# EAGLE design expansion_module_hdmi_out (EAGLE 8.0.0)
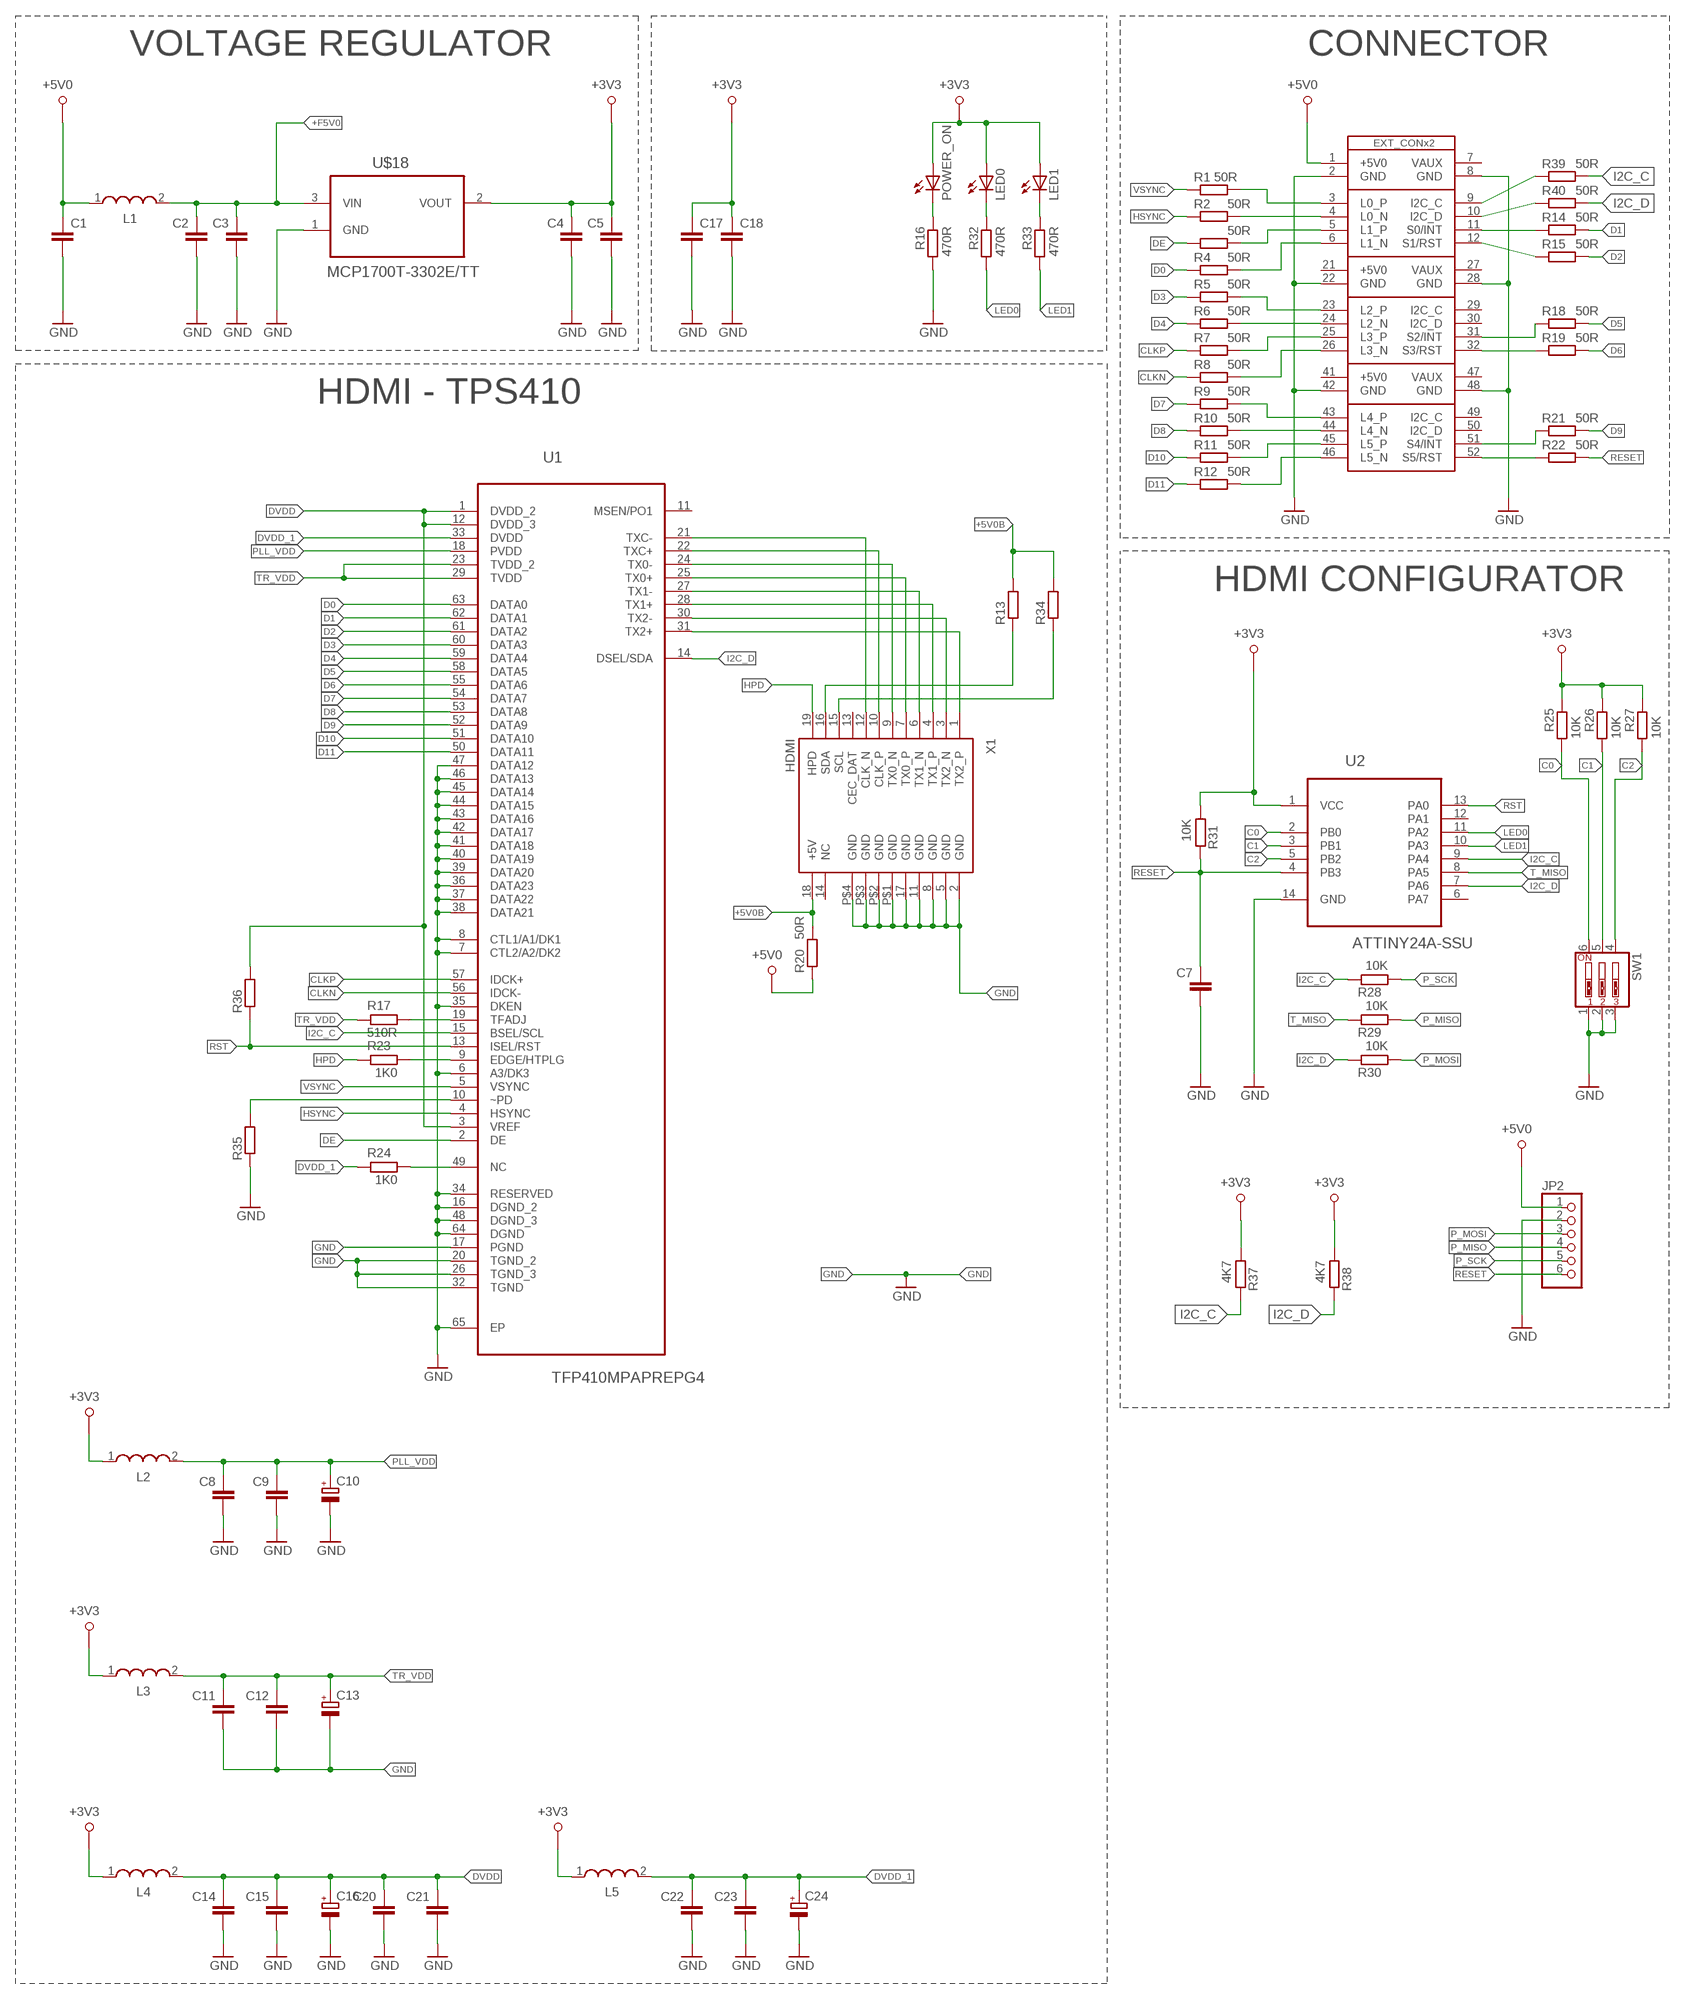
[diagram p0: schematic, sheet 1]

## Parts
C1  C-EUC1210K  [C1210K]
C2  C-EUC0805  [C0805]
C3  C-EUC0805  [C0805]
C4  C-EUC0805  [C0805]
C5  C-EUC0805  [C0805]
C7  C-EUC0805  [C0805]
C8  C-EUC0805  [C0805]
C9  C-EUC0805  [C0805]
C10  CPOL-EUSMCB  [SMC_B]
C11  C-EUC0805  [C0805]
C12  C-EUC0805  [C0805]
C13  CPOL-EUSMCB  [SMC_B]
C14  C-EUC0805  [C0805]
C15  C-EUC0805  [C0805]
C16  CPOL-EUSMCB  [SMC_B]
C17  C-EUC1210K  [C1210K]
C18  C-EUC1210K  [C1210K]
C20  C-EUC0805  [C0805]
C21  C-EUC0805  [C0805]
C22  C-EUC0805  [C0805]
C23  C-EUC0805  [C0805]
C24  CPOL-EUSMCB  [SMC_B]
JP2  PINHD-1X6  [1X06]
L1  WE-LQ_1210  [WE-LQ_M]
L2  WE-LQ_1210  [WE-LQ_M]
L3  WE-LQ_1210  [WE-LQ_M]
L4  WE-LQ_1210  [WE-LQ_M]
L5  WE-LQ_1210  [WE-LQ_M]
LED0  LEDCHIPLED_0805  [CHIPLED_0805]
LED1  LEDCHIPLED_0805  [CHIPLED_0805]
POWER_ON  LEDCHIPLED_0805  [CHIPLED_0805]
R1  50R  R-EU_R0805  [R0805]
R2  50R  R-EU_R0805  [R0805]
R3  50R  R-EU_R0805  [R0805]
R4  50R  R-EU_R0805  [R0805]
R5  50R  R-EU_R0805  [R0805]
R6  50R  R-EU_R0805  [R0805]
R7  50R  R-EU_R0805  [R0805]
R8  50R  R-EU_R0805  [R0805]
R9  50R  R-EU_R0805  [R0805]
R10  50R  R-EU_R0805  [R0805]
R11  50R  R-EU_R0805  [R0805]
R12  50R  R-EU_R0805  [R0805]
R13  R-EU_R0603  [R0603]
R14  50R  R-EU_R0805  [R0805]
R15  50R  R-EU_R0805  [R0805]
R16  470R  R-EU_R0805  [R0805]
R17  510R  R-EU_R0805  [R0805]
R18  50R  R-EU_R0805  [R0805]
R19  50R  R-EU_R0805  [R0805]
R20  50R  R-EU_R0805  [R0805]
R21  50R  R-EU_R0805  [R0805]
R22  50R  R-EU_R0805  [R0805]
R23  1K0  R-EU_R0805  [R0805]
R24  1K0  R-EU_R0805  [R0805]
R25  10K  R-EU_R0805  [R0805]
R26  10K  R-EU_R0805  [R0805]
R27  10K  R-EU_R0805  [R0805]
R28  10K  R-EU_R0805  [R0805]
R29  10K  R-EU_R0805  [R0805]
R30  10K  R-EU_R0805  [R0805]
R31  10K  R-EU_R0805  [R0805]
R32  470R  R-EU_R0805  [R0805]
R33  470R  R-EU_R0805  [R0805]
R34  R-EU_R0603  [R0603]
R35  R-EU_R0603  [R0603]
R36  R-EU_R0603  [R0603]
R37  4K7  R-EU_R0805  [R0805]
R38  4K7  R-EU_R0805  [R0805]
R39  50R  R-EU_R0805  [R0805]
R40  50R  R-EU_R0805  [R0805]
SW1  SW_DIP-3  [EDG-03]
U1  TFP410MPAPREPG4  [QFP50P1200X1200X120-65N]
U2  ATTINY24A-SSU  [SOIC127P600X175-14N]
U$1  SB_EXT_CON_X3  [SB_EXT_CON_X3_FULL]
U$18  MCP1700T-3302E/TT  [SOT95P237X112-3N]
X1  HDMI  [HDMI]

## Nets
+3V3: C4.2 C5.2 C17.1 C18.1 L2.1 L3.1 L4.1 L5.1 LED0.A LED1.A POWER_ON.A R25.2 R26.2 R27.2 R31.1 R37.1 R38.1 U2.1(VCC) U$18.2(VOUT)
+5V0: C1.1 JP2.1 L1.1 R20.1 U$1.1(+5V0)
+5V0B: R13.2 R20.2 R34.2 X1.18(+5V)
+F5V0: C2.2 C3.2 L1.2 U$18.3(VIN)
C0: R25.1 SW1.6 U2.2(PB0)
C1: R26.1 SW1.5 U2.3(PB1)
C2: R27.1 SW1.4 U2.5(PB2)
CLKN: R8.1 U1.56(IDCK-)
CLKP: R7.1 U1.57(IDCK+)
D0: R4.1 U1.63(DATA0)
D1: R14.2 U1.62(DATA1)
D2: R15.2 U1.61(DATA2)
D3: R5.1 U1.60(DATA3)
D4: R6.1 U1.59(DATA4)
D5: R18.2 U1.58(DATA5)
D6: R19.2 U1.55(DATA6)
D7: R9.1 U1.54(DATA7)
D8: R10.1 U1.53(DATA8)
D9: R21.2 U1.52(DATA9)
D10: R11.1 U1.51(DATA10)
D11: R12.1 U1.50(DATA11)
DE: R3.1 U1.2(DE)
DVDD: C14.2 C15.2 C16.+ C20.2 C21.2 L4.2 R36.2 U1.1(DVDD_2) U1.3(VREF) U1.12(DVDD_3)
DVDD_1: C22.2 C23.2 C24.+ L5.2 R24.2 U1.33(DVDD)
GND: C1.2 C2.1 C3.1 C4.1 C5.1 C7.1 C8.1 C9.1 C10.- C11.1 C12.1 C13.- C14.1 C15.1 C16.- C17.2 C18.2 C20.1 C21.1 C22.1 C23.1 C24.- JP2.2 R16.1 R35.1 SW1.1 SW1.2 SW1.3 U1.6(A3/DK3) U1.7(CTL2/A2/DK2) U1.8(CTL1/A1/DK1) U1.16(DGND_2) U1.17(PGND) U1.20(TGND_2) U1.26(TGND_3) U1.32(TGND) U1.34(RESERVED) U1.35(DKEN) U1.36(DATA23) U1.37(DATA22) U1.38(DATA21) U1.39(DATA20) U1.40(DATA19) U1.41(DATA18) U1.42(DATA17) U1.43(DATA16) U1.44(DATA15) U1.45(DATA14) U1.46(DATA13) U1.47(DATA12) U1.48(DGND_3) U1.64(DGND) U1.65(EP) U2.14(GND) U$1.2(GND) U$1.8(GND) U$1.22(GND) U$1.28(GND) U$1.42(GND) U$1.48(GND) U$18.1(GND) X1.2(GND) X1.5(GND) X1.8(GND) X1.11(GND) X1.17(GND) X1.P$1(GND) X1.P$2(GND) X1.P$3(GND) X1.P$4(GND)
HPD: R23.2 X1.19(HPD)
HSYNC: R2.1 U1.4(HSYNC)
I2C_C: R28.2 R37.2 R39.2 U1.15(BSEL/SCL) U2.9(PA4)
I2C_D: R30.2 R38.2 R40.2 U1.14(DSEL/SDA) U2.7(PA6)
LED0: R32.1 U2.11(PA2)
LED1: R33.1 U2.10(PA3)
N$1: R1.2 U$1.3(L0_P)
N$2: R2.2 U$1.4(L0_N)
N$3: R3.2 U$1.5(L1_P)
N$4: R4.2 U$1.6(L1_N)
N$5: R5.2 U$1.23(L2_P)
N$6: R15.1 U$1.12(S1/RST)
N$7: R14.1 U$1.11(S0/INT)
N$8: LED0.C R32.2
N$9: R18.1 U$1.31(S2/INT)
N$11: R6.2 U$1.24(L2_N)
N$12: R17.1 U1.19(TFADJ)
N$13: R7.2 U$1.25(L3_P)
N$14: R8.2 U$1.26(L3_N)
N$15: R9.2 U$1.43(L4_P)
N$16: R10.2 U$1.44(L4_N)
N$17: R11.2 U$1.45(L5_P)
N$19: R19.1 U$1.32(S3/RST)
N$20: R34.1 X1.15(SCL)
N$21: R21.1 U$1.51(S4/INT)
N$22: R22.1 U$1.52(S5/RST)
N$23: POWER_ON.C R16.2
N$24: U1.31(TX2+) X1.1(TX2_P)
N$25: U1.30(TX2-) X1.3(TX2_N)
N$30: U1.28(TX1+) X1.4(TX1_P)
N$31: U1.27(TX1-) X1.6(TX1_N)
N$32: U1.25(TX0+) X1.7(TX0_P)
N$33: U1.24(TX0-) X1.9(TX0_N)
N$34: U1.22(TXC+) X1.10(CLK_P)
N$35: R12.2 U$1.46(L5_N)
N$36: U1.21(TXC-) X1.12(CLK_N)
N$37: R35.2 U1.10(~PD)
N$39: R24.1 U1.49(NC)
N$42: R23.1 U1.9(EDGE/HTPLG)
N$43: LED1.C R33.2
N$44: R13.1 X1.16(SDA)
N$48: R40.1 U$1.10(I2C_D)
N$49: R39.1 U$1.9(I2C_C)
P_MISO: JP2.4 R29.1
P_MOSI: JP2.3 R30.1
P_SCK: JP2.5 R28.1
PLL_VDD: C8.2 C9.2 C10.+ L2.2 U1.18(PVDD)
RESET: C7.2 JP2.6 R22.2 R31.2 U2.4(PB3)
RST: R36.1 U1.13(ISEL/RST) U2.13(PA0)
T_MISO: R29.2 U2.8(PA5)
TR_VDD: C11.2 C12.2 C13.+ L3.2 R17.2 U1.23(TVDD_2) U1.29(TVDD)
VSYNC: R1.1 U1.5(VSYNC)
Unconnected: U1.11(MSEN/PO1) U2.6(PA7) U2.12(PA1) U$1.7(VAUX) U$1.21(+5V0) U$1.27(VAUX) U$1.29(I2C_C) U$1.30(I2C_D) U$1.41(+5V0) U$1.47(VAUX) U$1.49(I2C_C) U$1.50(I2C_D) X1.13(CEC_DAT) X1.14(NC)

## Notes on the sheet
- VOLTAGE REGULATOR | CONNECTOR
- HDMI - TPS410
- HDMI CONFIGURATOR

## Library data of the parts
C1-C5 C7-C9 C11 C12 C14 C15 C17 C18 C20-C23 = resistor:C-EU: CAPACITOR, European symbol
C10 C13 C16 C24 = resistor:CPOL-EU: POLARIZED CAPACITOR, European symbol
JP2 = pinhead:PINHD-1X6: PIN HEADER
L1-L5 = EagleLibrary_Wuerth_Elektronik_eiSos_rev16a:WE-LQ: SMD Inductor Characteristics Miniature chip inductor wound on a special ferrite core Small inductances for compact circuits High Q at high frequencies Low DC-resistance Operating temperature: –40 ºC to +125 ºC Applications Low power DC/DC-converters from Linear Technology, National Semiconductor, Texas Instruments, Fairchild Semiconductor, ON Semiconductor, STMicroelectronics, Maxim, MPS, Semtech, Exar, Analogic Tech, Diodes and Cologne Chip EMI-Filtering RF-circuits <http://katalog.we-online.de/media/images/eisos/IndLQ_pf2.jpg> Details see: http://katalog.we-online.de/en/pbs/WE-LQ? Updated by Dan Xu 2014-07-08 2014 (C) Wurth Elektronik
LED0 LED1 POWER_ON = led:LED: LED OSRAM: - CHIPLED LG R971, LG N971, LY N971, LG Q971, LY Q971, LO R971, LY R971 LH N974, LH R974 LS Q976, LO Q976, LY Q976 LO Q996 - Hyper CHIPLED LW Q18S LB Q993, LB Q99A, LB R99A - SideLED LS A670, LO A670, LY A670, LG A670, LP A670 LB A673, LV A673, LT A673, LW A673 LH A674 LY A675 LS A676, LA A676, LO A676, LY A676, LW A676 LS A679, LY A679, LG A679 - Hyper Micro SIDELED® LS Y876, LA Y876, LO Y876, LY Y876 LT Y87S - SmartLED LW L88C, LW L88S LB L89C, LB L89S, LG L890 LS L89K, LO L89K, LY L89K LS L896, LA L896, LO L896, LY L896 - TOPLED LS T670, LO T670, LY T670, LG T670, LP T670 LSG T670, LSP T670, LSY T670, LOP T670, LYG T670 LG T671, LOG T671, LSG T671 LB T673, LV T673, LT T673, LW T673 LH T674 LS T676, LA T676, LO T676, LY T676, LB T676, LH T676, LSB T676, LW T676 LB T67C, LV T67C, LT T67C, LS T67K, LO T67K, LY T67K, LW E67C LS E67B, LA E67B, LO E67B, LY E67B, LB E67C, LV E67C, LT E67C LW T67C LS T679, LY T679, LG T679 LS T770, LO T770, LY T770, LG T770, LP T770 LB T773, LV T773, LT T773, LW T773 LH T774 LS E675, LA E675, LY E675, LS T675 LS T776, LA T776, LO T776, LY T776, LB T776 LHGB T686 LT T68C, LB T68C - Hyper Mini TOPLED® LB M676 - Mini TOPLED Santana® LG M470 LS M47K, LO M47K, LY M47K Source: http://www.osram.convergy.de LUXEON: - LUMILED® LXK2-PW12-R00, LXK2-PW12-S00, LXK2-PW14-U00, LXK2-PW14-V00 LXK2-PM12-R00, LXK2-PM12-S00, LXK2-PM14-U00 LXK2-PE12-Q00, LXK2-PE12-R00, LXK2-PE12-S00, LXK2-PE14-T00, LXK2-PE14-U00 LXK2-PB12-K00, LXK2-PB12-L00, LXK2-PB12-M00, LXK2-PB14-N00, LXK2-PB14-P00, LXK2-PB14-Q00 LXK2-PR12-L00, LXK2-PR12-M00, LXK2-PR14-Q00, LXK2-PR14-R00 LXK2-PD12-Q00, LXK2-PD12-R00, LXK2-PD12-S00 LXK2-PH12-R00, LXK2-PH12-S00 LXK2-PL12-P00, LXK2-PL12-Q00, LXK2-PL12-R00 Source: www.luxeon.com KINGBRIGHT: KA-3528ASYC Source: www.kingbright.com
R1-R40 = resistor:R-EU_: RESISTOR, European symbol
SW1 = special:SW_DIP-3: DIP SWITCH
U1 = TFP410MPAPREPG4:TFP410MPAPREPG4: Digital Transmitter; AVAILABILITY: Good; DESCRIPTION: Enhanced Product Panelbus(Tm) Digital Transmitter 64-HTQFP -55 to 125; MF: Texas Instruments; MP: TFP410MPAPREPG4; PACKAGE: HTQFP-64 Texas Instruments; PRICE: 8.01 USD
U2 = Atmel_By_element14_Batch_1-00:ATTINY24A-SSU: 8-bit Microcontroller with In-System Programmable Flash; MPN: ATTINY24A-SSU; OC_FARNELL: 1699395; OC_NEWARK: 80P3681; PACKAGE: SOIC-14; SUPPLIER: Atmel
U$1 = al_smartboard:SB_EXT_CON_X3
U$18 = Microchip_By_element14_Batch_1:MCP1700T-3302E/TT: Low Quiescent Current LDO; MPN: MCP1700T-3302E/TT; OC_FARNELL: 1296592; OC_NEWARK: 88H9817; PACKAGE: SOT23-3; SUPPLIER: Microchip
X1 = raspberrypi_cm_al:HDMI

## Net classes
0 default: clearance 0.205 mm

## Board
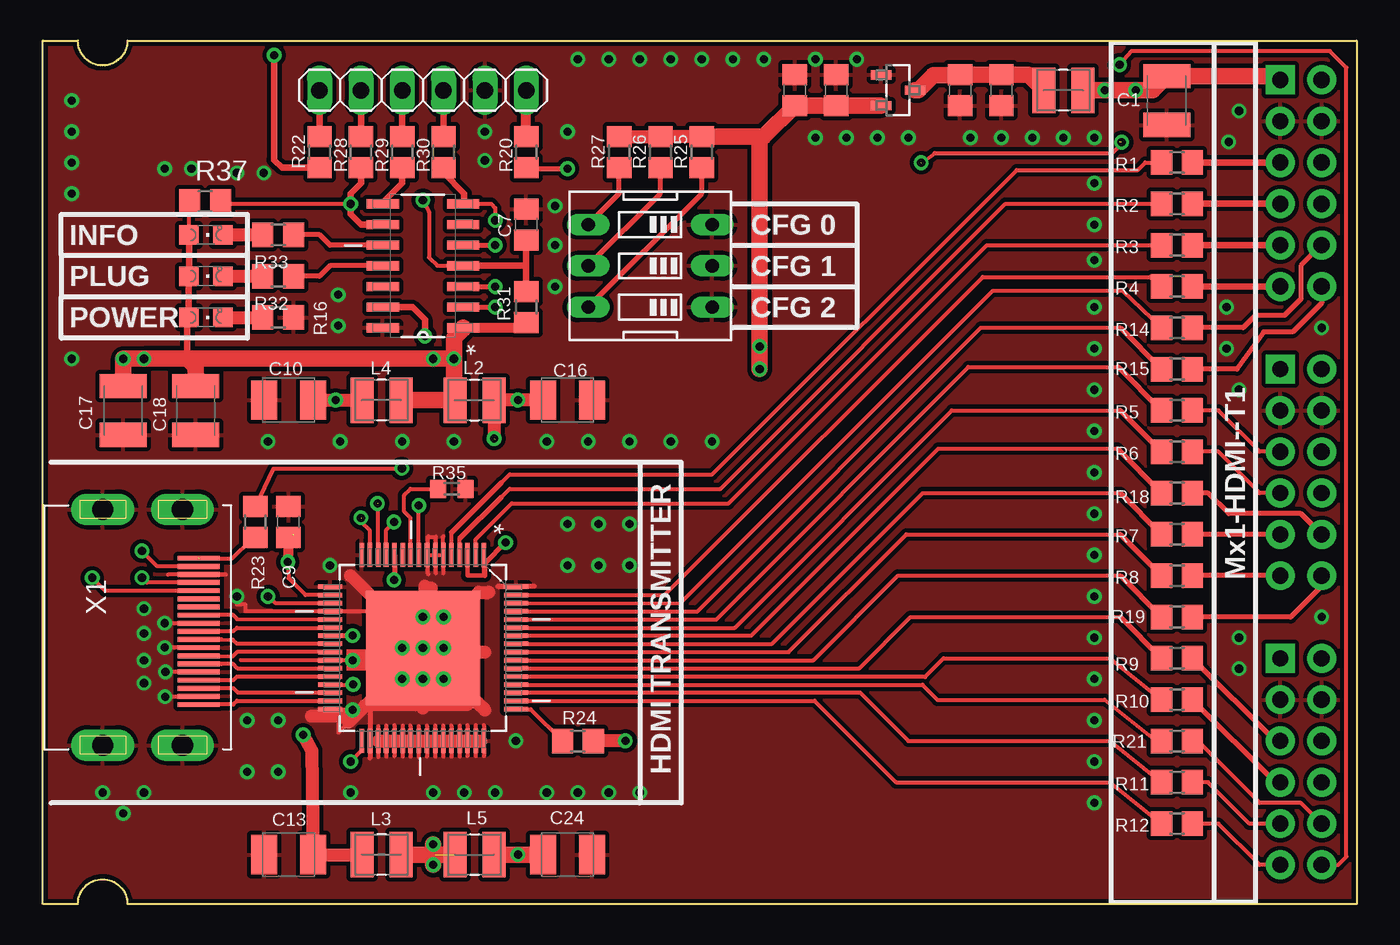
[diagram p1: board, top side]
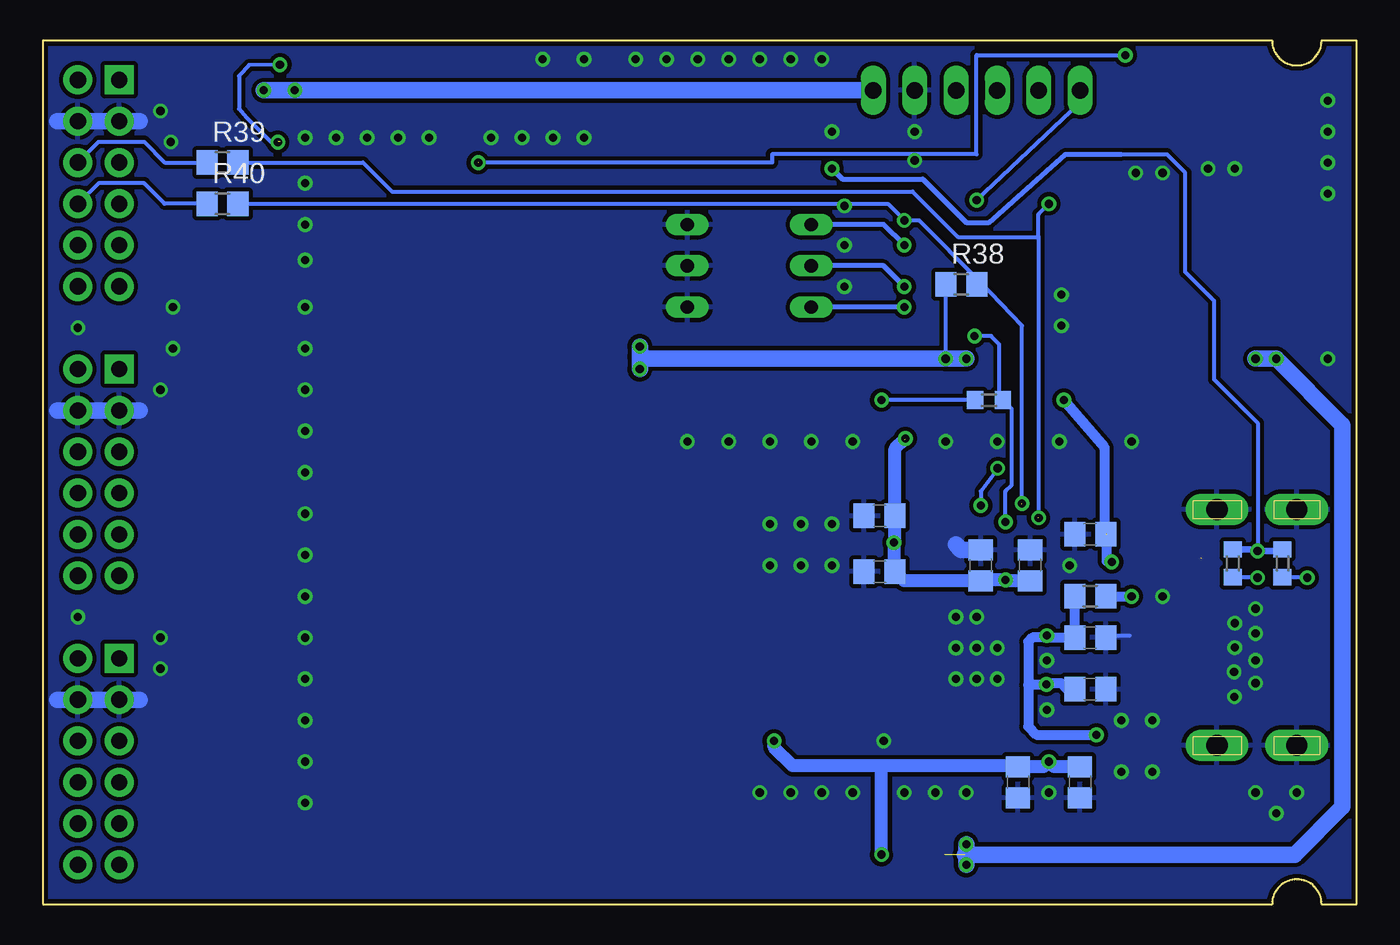
[diagram p2: board, bottom side, seen from below]

Size 80.77 x 53.09 mm. Coordinates in mm from the lower left corner, seen from the top.
Copper layers (1*16): Top 0.035mm / dielectric 1.5mm / Bottom 0.035mm
Design rules "default *": minimum track width 10mil, minimum drill 24mil, track to track 10mil, track to pad 8mil, pad to pad 8mil, via to via 8mil, smd to smd 8mil, copper to edge 10mil, drill to drill 10mil, minimum pad ring 10mil, minimum via ring 8mil, stop-mask expansion 4mil, vias tented up to drill 20mil, thermal gap 10mil

### Footprints (pad centres in the part's own frame; a part is rotated, then mirrored left to right if it is on the bottom)
C1210K = smd 1.5 x 2.9: 1 -1.5,0; 2 1.5,0
C0805 = smd 1.3 x 1.5: 1 -0.95,0; 2 0.95,0
SMC_B = smd 1.6 x 2.4: + -1.5,0; - 1.5,0
1X06 = drill 1.016 long: 1 -6.35,0; 2 -3.81,0; 3 -1.27,0; 4 1.27,0; 5 3.81,0; 6 6.35,0
WE-LQ_M = smd 1.4 x 2.8: 1 -1.2,0; 2 1.2,0
CHIPLED_0805 = smd 1.2 x 1.2: A 0,-1.05; C 0,1.05
R0805 = smd 1.3 x 1.5: 1 -0.95,0; 2 0.95,0
R0603 = smd 1 x 1.1: 1 -0.85,0; 2 0.85,0
EDG-03 = drill 0.813 long: 1 -2.54,-3.81; 2 0,-3.81; 3 2.54,-3.81; 4 2.54,3.81; 5 0,3.81; 6 -2.54,3.81
QFP50P1200X1200X120-65N = smd 1.473 x 0.279: 1 -5.715,3.759; 2 -5.715,3.251; 3 -5.715,2.743; 4 -5.715,2.261; 5 -5.715,1.753; 6 -5.715,1.245; 7 -5.715,0.762; 8 -5.715,0.254; 9 -5.715,-0.254; 10 -5.715,-0.762; 11 -5.715,-1.245; 12 -5.715,-1.753; 13 -5.715,-2.261; 14 -5.715,-2.743; 15 -5.715,-3.251; 16 -5.715,-3.759; 33 5.715,-3.759; 34 5.715,-3.251; 35 5.715,-2.743; 36 5.715,-2.261; 37 5.715,-1.753; 38 5.715,-1.245; 39 5.715,-0.762; 40 5.715,-0.254; 41 5.715,0.254; 42 5.715,0.762; 43 5.715,1.245; 44 5.715,1.753; 45 5.715,2.261; 46 5.715,2.743; 47 5.715,3.251; 48 5.715,3.759 | smd 0.279 x 1.473: 17 -3.759,-5.715; 18 -3.251,-5.715; 19 -2.743,-5.715; 20 -2.261,-5.715; 21 -1.753,-5.715; 22 -1.245,-5.715; 23 -0.762,-5.715; 24 -0.254,-5.715; 25 0.254,-5.715; 26 0.762,-5.715; 27 1.245,-5.715; 28 1.753,-5.715; 29 2.261,-5.715; 30 2.743,-5.715; 31 3.251,-5.715; 32 3.759,-5.715; 49 3.759,5.715; 50 3.251,5.715; 51 2.743,5.715; 52 2.261,5.715; 53 1.753,5.715; 54 1.245,5.715; 55 0.762,5.715; 56 0.254,5.715; 57 -0.254,5.715; 58 -0.762,5.715; 59 -1.245,5.715; 60 -1.753,5.715; 61 -2.261,5.715; 62 -2.743,5.715; 63 -3.251,5.715; 64 -3.759,5.715 | smd 7.01 x 7.01: 65 0,0
SOIC127P600X175-14N = smd 1.981 x 0.559: 1 -2.464,3.81; 2 -2.464,2.54; 3 -2.464,1.27; 4 -2.464,0; 5 -2.464,-1.27; 6 -2.464,-2.54; 7 -2.464,-3.81; 8 2.464,-3.81; 9 2.464,-2.54; 10 2.464,-1.27; 11 2.464,0; 12 2.464,1.27; 13 2.464,2.54; 14 2.464,3.81
SB_EXT_CON_X3_FULL = drill 1 pad 1.778 square: 1 50.8,5.08; 21 33.02,5.08; 41 15.24,5.08 | drill 1 pad 1.778: 2 48.26,5.08; 3 45.72,5.08; 4 43.18,5.08; 5 40.64,5.08; 6 38.1,5.08; 7 50.8,2.54; 8 48.26,2.54; 9 45.72,2.54; 10 43.18,2.54; 11 40.64,2.54; 12 38.1,2.54; 22 30.48,5.08; 23 27.94,5.08; 24 25.4,5.08; 25 22.86,5.08; 26 20.32,5.08; 27 33.02,2.54; 28 30.48,2.54; 29 27.94,2.54; 30 25.4,2.54; 31 22.86,2.54; 32 20.32,2.54; 42 12.7,5.08; 43 10.16,5.08; 44 7.62,5.08; 45 5.08,5.08; 46 2.54,5.08; 47 15.24,2.54; 48 12.7,2.54; 49 10.16,2.54; 50 7.62,2.54; 51 5.08,2.54; 52 2.54,2.54
SOT95P237X112-3N = smd 0.559 x 1.27: 1 -0.94,-1.041; 2 0.94,-1.041; 3 0,1.041
HDMI = smd 0.3 x 2.6: 1 4.75,4; 2 4.25,4; 3 3.75,4; 4 3.25,4; 5 2.75,4; 6 2.25,4; 7 1.75,4; 8 1.25,4; 9 0.75,4; 10 0.25,4; 11 -0.25,4; 12 -0.75,4; 13 -1.25,4; 14 -1.75,4; 15 -2.25,4; 16 -2.75,4; 17 -3.25,4; 18 -3.75,4; 19 -4.25,4 | drill 1.3 long: P$1 7.25,3; P$2 -7.25,3; P$3 -7.25,-1.9; P$4 7.25,-1.9

### Placement (x,y rotation side)
C1  69.09,49.4 270 top
C2  56.39,50.04 90 top
C3  58.93,50.04 90 top
C4  48.77,50.04 270 top
C5  46.23,50.04 270 top
C7  29.72,41.78 270 top
C8  16.38,22.73 0 bottom
C9  15.11,23.5 270 top
C10  15.11,30.99 180 top
C11  16.38,16.38 180 bottom
C12  16.38,13.21 180 bottom
C13  15.11,3.05 180 top
C14  29.34,23.88 0 bottom
C15  20.07,20.83 270 bottom
C16  32.26,30.99 0 top
C17  4.95,30.35 270 top
C18  9.4,30.35 270 top
C20  23.11,20.83 270 bottom
C21  29.34,20.45 0 bottom
C22  20.83,7.49 90 bottom
C23  17.02,7.49 90 bottom
C24  32.26,3.05 0 top
JP2  23.37,50.04 180 top
L1  62.74,50.04 180 top
L2  20.83,30.99 180 top
L3  20.83,3.05 180 top
L4  26.54,30.99 0 top
L5  26.54,3.05 0 top
LED0  10.03,38.61 270 top
LED1  10.03,41.15 270 top
POWER_ON  10.03,36.07 270 top
R1  69.72,45.59 0 top
R2  69.72,43.05 0 top
R3  69.72,40.51 0 top
R4  69.72,37.97 0 top
R5  69.72,30.35 0 top
R6  69.72,27.81 0 top
R7  69.72,22.73 0 top
R8  69.72,20.19 0 top
R9  69.72,15.11 0 top
R10  69.72,12.57 0 top
R11  69.72,7.49 0 top
R12  69.72,4.95 0 top
R13  7.62,20.96 90 bottom
R14  69.72,35.43 180 top
R15  69.72,32.89 180 top
R16  14.48,36.07 180 top
R17  16.38,18.92 180 bottom
R18  69.72,25.27 180 top
R19  69.72,17.65 180 top
R20  29.72,46.23 270 top
R21  69.72,10.03 180 top
R22  17.02,46.23 90 top
R23  13.08,23.5 270 top
R24  32.89,10.03 0 top
R25  40.51,46.23 90 top
R26  37.97,46.23 90 top
R27  35.43,46.23 90 top
R28  19.56,46.23 270 top
R29  22.1,46.23 270 top
R30  24.64,46.23 270 top
R31  29.72,36.7 90 top
R32  14.48,38.61 180 top
R33  14.48,41.15 180 top
R34  4.57,20.96 90 bottom
R35  25.15,25.53 180 top
R36  22.61,30.99 180 bottom
R37  9.98,43.21 0 top
R38  24.31,38.1 0 bottom
R39  69.72,45.59 0 bottom
R40  69.72,43.05 0 bottom
SW1  37.34,39.24 90 top
U1  23.37,15.75 270 top
U2  23.37,39.24 180 top
U$1  81.15,-0.13 90 top
U$18  52.58,50.04 270 top
X1  5.59,17.02 270 top

### Tracks (layer width: path | path; a pad name or v marks a point on that pad's centre or on a via)
+3V3  (via drill 0.5)  (1 unrouted)
  Top 0.254: 9.02,38.48 9.02,38.57 LED0.A | R37.1 8.98,43.16 LED1.A
  Top 0.406: LED1.A 9.02,41.11 9.02,38.48 8.98,38.45 POWER_ON.A 8.89,35.98 8.89,33.53
  Top 0.61: U2.1 29.4,35.43 R31.1
  Top 0.813: R27.2 R26.2 R25.2
  Top 1.016: U$18.2 51.53,49.09 C4.2 C5.2 44.32,47.18 | 44.32,47.18 R25.2 | 44.32,47.18 44.07,46.93 v44.07,34.29 v44.07,32.89 | L2.1 L4.1 25.27,31.06 v25.27,33.53 | U2.1 25.83,35.36 25.27,34.8 v25.27,33.53 | 8.89,33.53 v24,33.53 v25.27,33.53 | 8.89,33.53 v6.22,33.53 v4.95,33.53 C17.1 | L5.1 L3.1 | C18.1 9.4,33.02 8.89,33.53
  Bottom 0.254: R38.1 25.27,37.66 v25.27,33.53
  Bottom 1.016: v44.07,34.29 44.07,33.66 | 44.07,33.66 v44.07,32.89 | 44.07,33.66 43.94,33.53 v25.27,33.53 v24,33.53 | v6.22,33.53 v4.95,33.53 0.89,29.46 0.89,5.97 3.81,3.05 24.07,3.05
+5V0  (via drill 0.5)
  Top 0.61: R20.1 JP2.1
  Top 1.016: U$1.1 75.84,50.9 C1.1 68.22,50.04 v67.18,50.04 v65.28,50.04 L1.1
  Bottom 1.016: v67.18,50.04 JP2.1
+5V0B  (via drill 0.5)
  Top 0.254: 9.58,20.78 X1.18 7.04,20.77 v6.1,21.72
  Top 0.305: R20.2 29.78,45.21 v32.26,45.21
  Bottom 0.254: 14.48,46.1 11.68,46.1 10.54,44.96 10.54,38.86 8.76,37.08 8.76,32.26 6.1,29.59 v6.1,21.72
  Bottom 0.305: v32.26,45.21 31.62,44.58 26.67,44.58 24,41.91 22.61,41.91 17.91,46.1 14.48,46.1
  Bottom 0.406: R13.2 6.18,21.81 v6.1,21.72 4.66,21.72 R34.2
+F5V0
  Top 1.016: L1.2 60.59,50.99 C3.2 C2.2 56.35,50.95 54.74,50.95 53.82,50.04 U$18.3
C0  (via drill 0.5)
  Top 0.305: SW1.6 40.51,43.69 R25.1 | U2.2 v27.81,36.7
  Bottom 0.305: v27.81,36.7 SW1.6
C1  (via drill 0.5)
  Top 0.305: SW1.5 37.97,43.69 R26.1 | U2.3 v27.81,37.97
  Bottom 0.305: v27.81,37.97 29.08,39.24 SW1.5
C2  (via drill 0.5)
  Top 0.305: SW1.4 35.43,43.69 R27.1 | U2.5 v27.81,40.51
  Bottom 0.305: v27.81,40.51 29.08,41.78 SW1.4
CLKN
  Top 0.254: 66.23,22.73 53.09,22.73 45.85,15.49 U1.56
  Top 0.305: 66.23,22.73 R8.1
CLKP
  Top 0.254: 66.23,25.27 54.1,25.27 44.83,16 U1.57
  Top 0.305: 66.23,25.27 R7.1
D0
  Top 0.254: R4.1 68.45,37.97 | R4.1 69.09,37.97 | R4.1 68.06,38.56 57.78,38.56 38.23,19 U1.63
  Top 0.305: 68.74,38 R4.1 68.57,38.18
D1
  Top 0.254: R14.2 66.36,37.72 58.42,37.72 39.22,18.52 29.16,18.49 U1.62
D2
  Top 0.254: U1.61 40.26,18.01 57.66,35.43 66.23,35.43
  Top 0.305: 66.23,35.43 R15.2
D3
  Top 0.254: U1.60 41.4,17.5 56.9,33.02 66.11,33.02
  Top 0.305: 66.11,33.02 R5.1
D4
  Top 0.254: U1.59 42.55,16.99 55.88,30.35 66.23,30.35
  Top 0.305: 66.23,30.35 R6.1
D5
  Top 0.254: 66.04,28 55.05,28 43.56,16.51 U1.58
  Top 0.305: 66.04,28 R18.2
D6
  Top 0.254: 66.23,20.19 52.58,20.19 47.37,14.99 U1.55
  Top 0.305: 66.23,20.19 R19.2
D7
  Top 0.254: 66.23,17.65 53.34,17.65 50.19,14.5 U1.54
  Top 0.305: 66.23,17.65 R9.1
D8
  Top 0.254: R10.1 65.6,15.11 55.37,15.11 54.23,13.97 54.2,13.99 U1.53
D9
  Top 0.254: R21.2 68.45,10.03 65.28,12.57 54.99,12.57 54.08,13.49 U1.52
D10
  Top 0.254: 65.6,10.03 R11.1 | 65.6,10.03 53.21,10.03 50.24,13 U1.51 | 65.6,10.03 65.59,10.04
D11
  Top 0.254: R12.1 65.6,7.49 52.45,7.49 47.45,12.5 U1.50
DE
  Top 0.254: U1.2 26.62,22.43 28.83,24.64 42.16,24.64 58.04,40.51 R3.1
  Top 0.305: R3.1
DVDD  (via drill 0.5)  (1 unrouted)
  Top 0.279: U1.3 26.11,20.19 27.18,20.19 27.13,20.24 U1.1
  Top 0.305: 27.18,20.19 27.18,20.96 v28.45,22.23 | U1.12 21.62,19.96 v21.59,19.94
  Top 0.813: C16.+ v29.21,30.99 L4.2 27.74,28.61 27.74,28.6
  Bottom 0.254: R36.2 v29.21,30.99
  Bottom 0.813: 27.81,28.58 28.39,28 C14.2 28.39,22.29 v28.45,22.23 28.45,20.51 C21.2 27.82,19.88 C20.2 23.05,19.94 v21.59,19.94 21.53,19.88 C15.2
DVDD_1  (via drill 0.5)
  Top 0.254: U1.33 19.61,9.45 v18.92,8.76
  Top 0.813: v35.81,10.03 R24.2
  Top 1.016: L5.2 v29.21,3.05 C24.+
  Bottom 0.813: C23.2 18.6,8.44 v18.92,8.76 19.24,8.44 C22.2 20.89,8.51 29.21,8.51 | v29.21,3.05 29.21,8.51 | 29.21,8.51 34.67,8.51 35.81,9.65 v35.81,10.03
GND  (via drill 0.5)
  Top 0.254: U1.8 U1.7 U1.6 | U1.36 U1.35 U1.34 | v19.05,14.99 U1.26 12.19,14.99 | U1.32 19.05,11.99 18.8,11.73 18.8,11.18 | U1.6 24.61,20.35 | U1.6 24.61,22.63 | 23.7,20.3 23.7,22.63 23.75,22.58 24.16,22.58 24.16,20.35 | 20.62,10.95 20.62,9.04 | 21.11,10.97 21.11,9.07 | 21.62,11 21.62,9.09 | 22.12,10.97 22.12,9.07 | 22.61,10.97 22.61,9.07 | 23.11,10.95 23.11,9.04 | 23.62,10.97 23.62,9.07 | 24.13,10.97 24.13,9.07 | 24.61,10.97 24.61,9.07 | 25.12,10.97 25.12,9.07 | 25.63,10.97 25.63,9.07 | 26.11,11 26.11,9.09 | 26.62,11 26.62,9.09 | 27.13,11 27.13,9.09 | 20.12,8.99 20.12,10.67 | X1.17 11.25,20.27 X1.17 | X1.17 7.7,20.27 | X1.11 v7.49,17.27 | X1.8 v7.49,15.77 | X1.5 9.58,14.28 v7.54,14.28 | X1.2 9.57,12.75 v7.52,12.75 | 18.54,11.43 18.54,11.56 | 18.54,11.43 v19.05,11.94 18.16,11.05 18.16,10.54 18.54,10.92 18.54,11.43 | 20.07,18.06 20.07,18.01 U1.20 12.47,18.01 12.47,18.42 11.94,18.42 v11.94,18.92 | 29.03,19.56 U1.64 27.99,19.51 27.94,19.56 29.03,19.56
  Top 0.305: U1.42 U1.40 U1.39 | U1.48 26.92,10.03 U1.47 U1.46 U1.45 U1.44 U1.43 U1.42 | U1.41 U1.42 | U1.37 U1.36 | U1.64 29.13,19.56 30.23,19.56 | v22.1,13.84 20.12,13.84 20.12,8.99 | 26.16,12.19 26.73,12.19 26.73,12.38
  Top 0.61: 19.81,12.19 26.16,12.19
  Top 0.813: 27.18,11.94 26.73,12.38 U1.65 | U1.65 26.8,19.18 27.43,19.18 | v23.37,17.65 23.49,17.78 23.49,19.56 23.62,19.43 23.88,19.43 | U1.65 23.62,15.49 27.18,15.49 | U1.65 23.37,12.06 | 18.8,11.18 19.81,12.19 U1.65 | U1.65 18.92,20.19 | U1.35 26.92,10.03 | v19.05,11.94 18.67,11.56 18.54,11.56 16.51,11.56
  Bottom 0.254: C11.1 15.31,16.51 13.97,16.51
  Bottom 1.016: 79.88,48.13 U$1.2 74.8,48.13 | 79.88,30.35 U$1.22 74.8,30.35 | 79.88,12.57 U$1.42 74.8,12.57 | C20.1 24.32,21.78 24.64,22.1
  other vias: 64.64,36.7 64.64,34.16 64.64,31.62 64.64,29.08 64.64,26.54 64.64,24 64.64,21.46 64.64,18.92 64.64,16.38 64.64,13.84 64.64,11.3 64.64,8.76 64.64,6.22 64.64,44.32 64.64,47.12 24.64,17.65 24.64,13.84 22.1,15.75 23.37,15.75 24.64,15.75 23.37,13.84 64.64,41.78 64.64,39.6 78.61,35.43 78.61,17.65 62.74,47.12 60.83,47.12 58.93,47.12 57.02,47.12 53.21,47.12 51.31,47.12 49.4,47.12 47.5,47.12 44.32,51.94 42.42,51.94 40.51,51.94 38.61,51.94 36.7,51.94 34.8,51.94 32.89,51.94 47.5,51.94 50.04,51.94 27.18,47.5 27.18,45.72 32.26,47.5 18.29,28.45 22.1,28.45 25.27,28.45 13.84,28.45 1.78,33.53 1.78,43.69 1.78,45.59 1.78,47.5 1.78,49.4 9.14,45.21 7.49,45.21 11.94,44.96 13.59,44.96 17.65,20.83 29.08,10.03 30.99,6.86 32.89,6.86 34.8,6.86 36.7,6.86 27.81,6.86 25.91,6.86 24,6.86 32.26,20.83 32.26,23.37 34.16,23.37 36.07,23.37 36.07,20.83 34.16,20.83 73.53,16.38 73.53,14.48 73.53,31.62 73.53,48.77 72.9,46.86 3.68,6.86 4.95,5.59 6.22,6.86 12.57,8.13 14.48,8.13 72.77,36.7 72.77,34.16 30.99,28.45 33.53,28.45 36.07,28.45 38.61,28.45 41.15,28.45 18.92,6.86 31.5,37.97 31.5,40.51 31.5,42.93 18.16,35.56 18.16,37.47 6.22,18.16 12.57,11.3 14.48,11.3 6.22,16.64 6.22,14.99 6.22,13.59
  pour Bottom (isolate 0.254, rank 2): 81.15,53.21 -0.13,52.83 -0.13,-0.13 81.15,-0.13
  pour Top (isolate 0.254): 62.74,53.21 81.15,53.21 81.15,-0.13 62.74,-0.13
  pour Top (isolate 0.254): 62.74,53.21 81.15,53.21 81.15,-0.13 62.74,-0.13
  pour Top (isolate 0.254): 62.74,53.21 81.15,53.21 81.15,-0.13 62.74,-0.13
  pour Top (isolate 0.254, rank 2): 0,53.21 81.15,53.21 81.15,-0.13 -0.13,-0.13
HPD  (1 unrouted)
  Top 0.254: X1.19 11.66,21.26 12.83,22.43 R23.2
HSYNC
  Top 0.254: U1.4 25.63,22.48 | 28.19,25.02 28.7,25.53 41.66,25.53 59.18,43.05 R2.1
  Top 0.305: 25.63,22.48 28.19,25.02
I2C_C  (via drill 0.5)  (1 unrouted)
  Top 0.254: U1.15 20.12,22.96 19.61,23.47 19.61,23.75 | R37.2 11.09,43.05 v18.92,43.05
  Top 0.406: R28.2 19.56,44.32 18.92,43.69 v18.92,43.05 18.92,42.42 19.56,41.78 U2.9
  Bottom 0.254: v18.92,43.05 19.56,42.42 19.56,41.02 | 19.56,41.02 v19.56,23.75 | R39.2 61.09,45.59 59.31,43.82 27.3,43.82 24.51,41.02 19.56,41.02
I2C_D  (via drill 0.5)  (1 unrouted)
  Top 0.254: U1.14 20.62,24.64 | U2.7 27.56,43.05 27.81,42.8 v27.81,42.04
  Top 0.406: R30.2 24.64,44.96 25.91,43.69 25.91,43.13 U2.7
  Bottom 0.254: v20.57,24.64 20.57,35.56 23.16,38.29 | 23.16,38.29 26.92,42.04 v27.81,42.04 28.83,43.05 R40.2 | R38.2 23.17,38.29 23.16,38.29
LED0
  Top 0.305: U2.11 17.65,39.24 17.02,38.61 R32.1
LED1
  Top 0.305: U2.10 17.65,40.51 17.02,41.15 R33.1
N$1
  Top 0.406: U$1.3 R1.2
N$2
  Top 0.406: U$1.4 R2.2
N$3
  Top 0.406: U$1.5 R3.2
N$4
  Top 0.254: 70.74,37.97 R4.2
  Top 0.406: U$1.6 70.74,37.97
N$5
  Top 0.254: U$1.23 74.8,27.81 72.26,30.35 R5.2
N$6
  Top 0.305: U$1.12 78.61,36.96 76.83,35.18 75.06,35.18 73.41,32.89 R15.1
N$7
  Top 0.305: U$1.11 77.34,39.24 77.34,37.21 76.33,36.2 74.55,36.2 73.79,35.43 R14.1
N$8
  Top 0.813: LED0.C R32.2
N$9
  Top 0.305: U$1.31 77.34,24 72.9,24 71.63,25.27 R18.1
N$11
  Top 0.254: U$1.24 74.8,25.27 72.26,27.81 R6.2
N$12  (via drill 0.5)
  Top 0.254: v13.84,18.92 13.89,18.92 14.33,18.49 U1.19
  Bottom 0.61: R17.1 v13.84,18.92
N$13
  Top 0.305: U$1.25 R7.2
N$14
  Top 0.305: U$1.26 R8.2
N$15
  Top 0.305: U$1.43 75.75,10.03 R9.2
N$16
  Top 0.305: U$1.44 75.75,7.49 R10.2
N$17
  Top 0.254: U$1.45 74.17,4.95 71.63,7.49 R11.2
  Top 0.305: 75.75,4.95 U$1.45
N$18  (via drill 0.5)
  other vias: 27.74,28.63
N$19
  Top 0.305: U$1.32 78.61,19.56 76.71,17.65 R19.1
N$20  (via drill 0.5)
  Top 0.254: X1.15 3.85,19.27 v3.05,20.07
  Bottom 0.254: R34.1 3.09,20.11 v3.05,20.07
N$21
  Top 0.254: U$1.51 77.34,6.22 74.8,6.22 70.99,10.03 R21.1
N$22  (via drill 0.5)  (2 unrouted)
  Top 0.254: U$1.52 79.63,2.41 80.14,2.92 80.14,51.44 79.12,52.45 66.93,52.45 v66.19,51.61 | v54,45.59 54.03,45.57 54.84,46.18 65.73,46.18 66.04,46.46 66.29,46.89
  Top 0.406: v14.22,52.2 14.22,45.75 14.71,45.29 R22.1
  Bottom 0.254: v66.19,51.61 68.1,51.59 68.71,50.93 68.71,48.9 68.28,48.39 66.75,46.86 66.17,46.86 | v14.22,52.2 23.37,52.2 23.37,46.1 35.94,46.1 35.94,45.59 53.97,45.59
N$23
  Top 0.813: POWER_ON.C R16.2
N$24
  Top 0.254: U1.31 11.94,12.5 11.71,12.27 X1.1
N$25
  Top 0.254: U1.30 11.99,13 11.86,13.13 11.73,13.27 X1.3
N$30
  Top 0.254: U1.28 11.94,13.99 11.86,13.92 11.71,13.77 X1.4
N$31
  Top 0.254: U1.27 11.96,14.5 11.7,14.77 arc-3 X1.6
N$32
  Top 0.254: U1.25 11.94,15.49 11.68,15.24 9.58,15.26 9.58,15.27 X1.7
N$33
  Top 0.254: U1.24 11.94,16 11.68,16.26 arc6 X1.9
N$34
  Top 0.254: U1.22 11.94,16.99 11.71,16.77 X1.10
N$35
  Top 0.254: U$1.46 74.8,2.41 72.26,4.95 R12.2
  Top 0.305: 75.75,2.41 U$1.46
N$36
  Top 0.254: U1.21 17.32,17.5 11.94,17.53 11.7,17.77 X1.12
N$37
  Top 0.254: U1.10 22.61,23.75 22.23,24.13 22.23,25.15 22.61,25.53 R35.2
N$38  (via drill 0.5)
  Top 1.016: v24,3.68 24,2.41
  Bottom 1.016: v24,3.68 24,2.41
N$39
  Top 0.254: 29.41,11.99 U1.49 29.99,11.99 R24.1
N$40  (via drill 0.5)
  other vias: 66.32,46.84
N$41  (via drill 0.5)
  other vias: 24,2.41
N$42  (via drill 0.5)
  Top 0.254: R23.1 14.19,26.77 v22.07,26.8 | U1.9 v23.11,24.51
  Bottom 0.254: v22.07,26.8 23.11,25.4 v23.11,24.51
N$43
  Top 0.813: LED1.C R33.2
N$44  (via drill 0.5)
  Top 0.254: X1.16 6.39,19.77 v6.1,20.07
  Bottom 0.254: R13.1 6.13,20.11 v6.1,20.07
N$48
  Bottom 0.254: R40.1 73.28,43.05 74.55,44.32 77.34,44.32 U$1.10
N$49
  Bottom 0.254: U$1.9 77.34,46.86 74.55,46.86 73.28,45.59 R39.1
P_MISO
  Top 0.406: R29.1 JP2.4
P_MOSI
  Top 0.406: R30.1 JP2.3
P_SCK
  Top 0.406: R28.1 JP2.5
PLL_VDD  (via drill 0.5)  (1 unrouted)
  Top 0.254: U1.18 16.15,19 15.11,20.04 v15.06,21.03
  Top 0.61: C9.2 v15.06,21.03
  Top 0.813: C10.+ v18.01,30.99 L2.2
  Bottom 0.61: v15.06,21.03 15.37,21.08 15.37,22.73 | C8.2 15.49,22.79 15.49,28.07 v18.01,30.99
RESET  (via drill 0.5)
  Top 0.254: v23.37,43.28 23.75,42.55 23.75,39.75 24.26,39.24 U2.4
  Top 0.406: U2.4 29.72,39.24 | 29.72,39.24 R31.2 | C7.2 29.72,39.24 | JP2.6 R22.2
  Bottom 0.254: v23.37,43.28 17.02,49.28 JP2.6
RST  (via drill 0.5)
  Top 0.254: U1.13 21.11,23.01 v21.59,23.5
  Top 0.406: U2.13 22.73,36.7 23.49,35.94 v23.49,34.93
  Bottom 0.254: v21.59,23.5 21.59,25.4 21.21,25.78 21.21,30.44 R36.1 21.97,31.2 21.97,34.42 22.48,34.93 v23.49,34.93
T_MISO
  Top 0.406: U2.8 20.9,43.13 22.1,44.32 R29.2
TR_VDD  (via drill 0.5)
  Top 0.254: U1.29 19.05,13.49
  Top 0.305: U1.23 v19.05,16.51
  Top 0.61: 19.05,13.49 v19.08,13.51
  Top 0.813: L3.2 C13.+ 16.54,9.45 v16,10.41
  Bottom 0.61: 19.13,13.46 v19.08,13.51 | v19.08,13.51 19.02,13.46 | R17.2 C11.2 18.92,16.38 v19.05,16.51 19.18,16.38 19.94,16.38 20.19,16.13 20.19,13.46 | v16,10.41 19.69,10.41 20.19,10.92 20.19,13.46 | 20.19,13.46 20.14,13.51 v19.08,13.51 | v19.08,13.51 19,13.59 18.16,13.59 17.78,13.21 C12.2
VSYNC
  Top 0.254: U1.5 25.12,22.86 | 28.19,25.91 28.7,26.42 41.15,26.42 59.87,45.14 67.31,45.14 67.77,45.59 R1.1
  Top 0.305: 25.12,22.86 28.19,25.91
(copper drawn outside any net)
  shapes: Top area x1

### Text on the board
tPlace: Mx1-HDMI--T1
tNames: CFG 0 | INFO | CFG 1 | PLUG | POWER | CFG 2 | HDMI TRANSMITTER